# EAGLE schematic Main_ATMEGA328P (EAGLE 6.4)
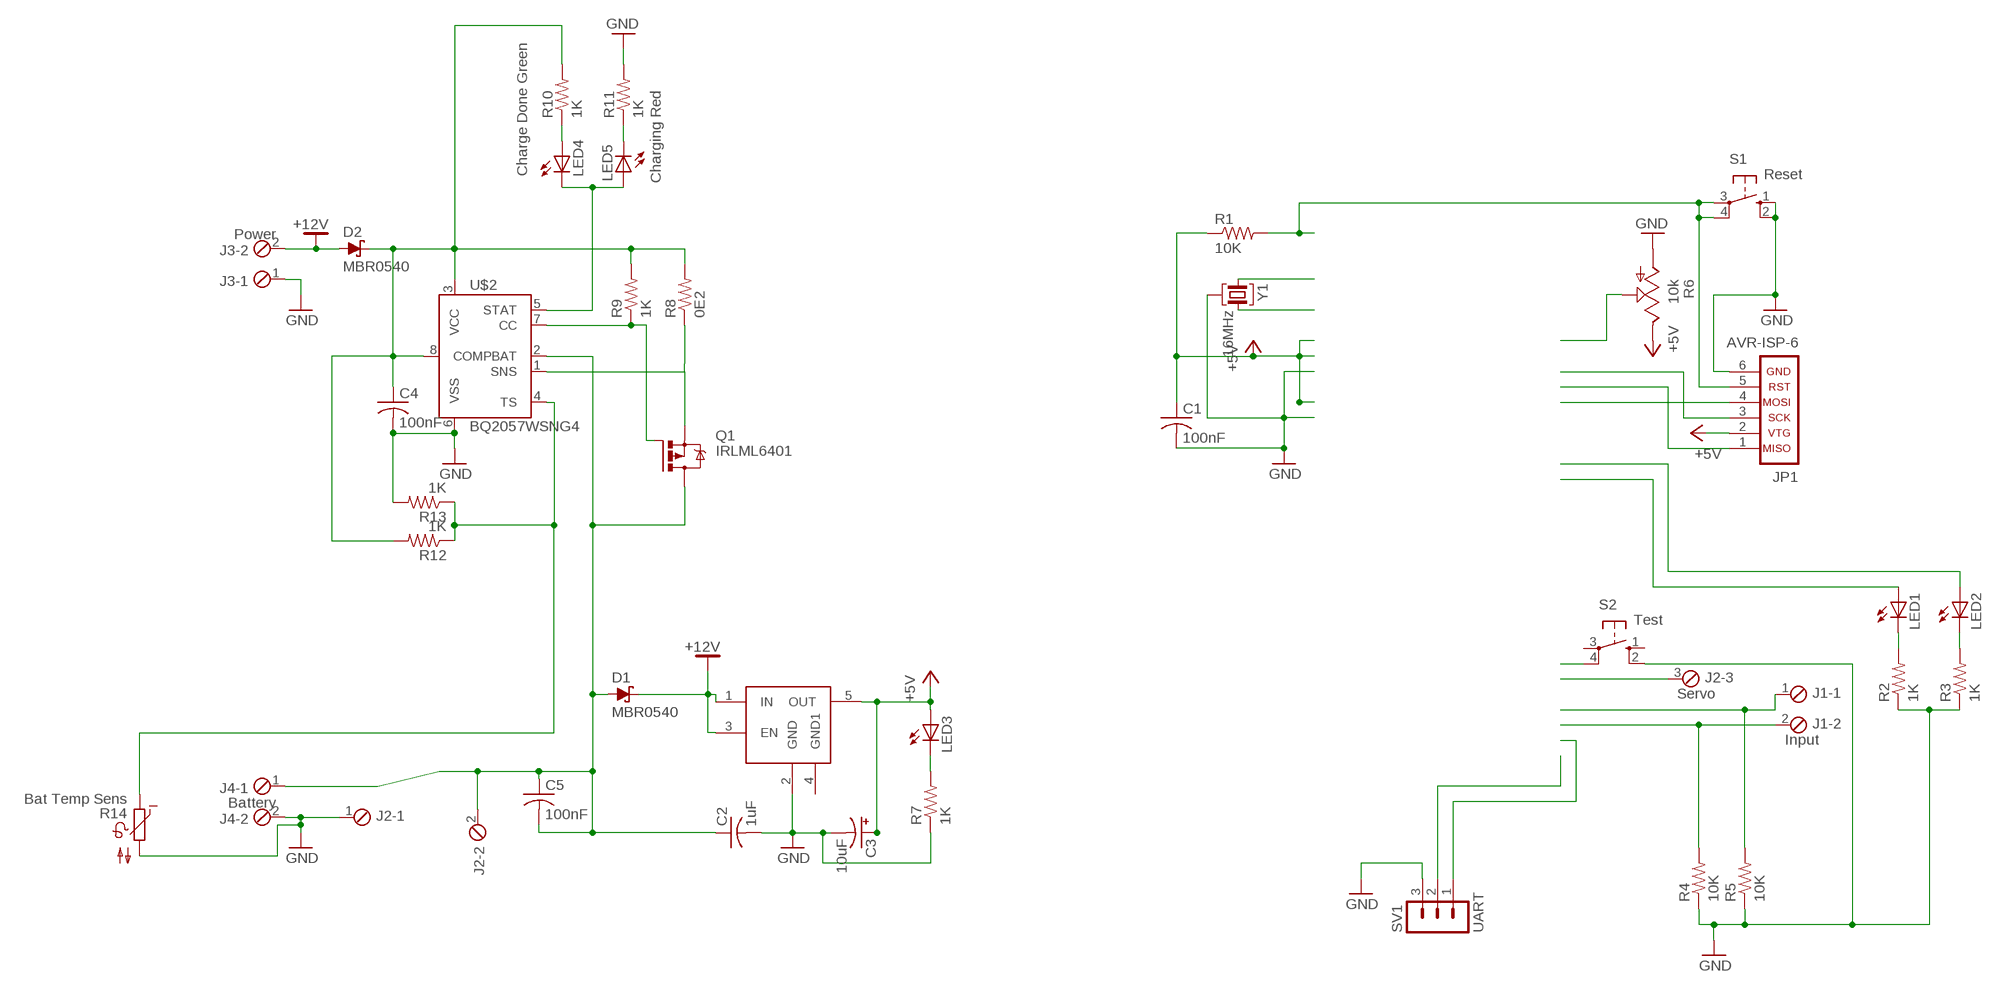
[diagram p0: schematic, sheet 1]

## Parts
C1  100nF  C-USC0805K  [C0805K]
C2  1uF  C-USC0805K  [C0805K]
C3  10uF  CPOL-USE2.5-7  [E2,5-7]
C4  100nF  C-USC0805K  [C0805K]
C5  100nF  C-USC0805K  [C0805K]
D1  MBR0540  [SOD123]
D2  MBR0540  [SOD123]
J1  Input  796689-2  [796689-2]
J2  Servo  796689-3  [796689-3]
J3  Power  796689-2  [796689-2]
J4  Battery  796689-2  [796689-2]
JP1  AVR-ISP-6  [AVR-ISP-6]
LED1  LEDCHIPLED_0805  [CHIPLED_0805]
LED2  LEDCHIPLED_0805  [CHIPLED_0805]
LED3  LEDCHIPLED_0805  [CHIPLED_0805]
LED4  Charge Done Green  LEDCHIPLED_0805  [CHIPLED_0805]
LED5  Charging Red  LEDCHIPLED_0805  [CHIPLED_0805]
Q1  IRLML6401  IRLML5203  [MICRO3]
R1  10K  R-US_R0805  [R0805]
R2  1K  R-US_R0805  [R0805]
R3  1K  R-US_R0805  [R0805]
R4  10K  R-US_R0805  [R0805]
R5  10K  R-US_R0805  [R0805]
R6  10k  TRIM_US-PT-10  [PT-10]
R7  1K  R-US_R0805  [R0805]
R8  0E2  R-US_M1206  [M1206]
R9  1K  R-US_R0805  [R0805]
R10  1K  R-US_R0805  [R0805]
R11  1K  R-US_R0805  [R0805]
R12  1K  R-US_R0805  [R0805]
R13  1K  R-US_R0805  [R0805]
R14  Bat Temp Sens  NTC640  [P640]
S1  Reset  10-XX  [B3F-10XX]
S2  Test  10-XX  [B3F-10XX]
SV1  UART  MA03-1  [MA03-1]
U$1  LP2981-50  TPS783XX  [DBV-R-PDSO-G5]
U$2  BQ2057WSNG4  [D_R-PDSO-G8]
Y1  16MHz  ZTT5X10  [5X10-3]

## Nets
+5V: C1.1 C3.+ JP1.2 LED3.A R1.1 R6.E U$1.5(OUT)
+12V: D1.C D2.A J3.2 U$1.1(IN) U$1.3(EN)
GND: C1.2 C2.2 C3.- C4.2 J2.1 J3.1 J4.2 JP1.6 R2.1 R3.1 R4.1 R5.1 R6.A R7.1 R11.2 R13.2 R14.2 S1.1(S) S1.2(S1) S2.2(S1) SV1.3 U$1.2(GND) U$2.6(VSS) Y1.2
N$1: J1.2 R4.2
N$2: JP1.5 R1.2 S1.3(P) S1.4(P1)
N$3: JP1.3
N$4: JP1.4
N$5: JP1.1
N$6: J1.1 R5.2
N$7: SV1.1
N$8: LED4.C LED5.A U$2.5(STAT)
N$9: Y1.3
N$10: Y1.1
N$11: J2.3
N$12: LED1.C R2.2
N$13: LED2.C R3.2
N$14: SV1.2
N$15: LED1.A
N$16: R6.S
N$17: LED2.A
N$18: LED3.C R7.2
N$19: S2.4(P1)
N$20: C2.1 C5.1 C5.2 D1.A J2.2 J4.1 Q1.3(D) U$2.2(BAT)
N$27: Q1.2(S) R8.1 U$2.1(SNS)
N$29: Q1.1(G) R9.1 U$2.7(CC)
N$30: LED5.C R11.1
N$31: LED4.A R10.1
N$32: R12.1 R13.1 R14.1 U$2.4(TS)
N$34: C4.1 D2.C R8.2 R9.2 R10.2 R12.2 U$2.3(VCC) U$2.8(COMP)
Unconnected: S2.1(S) S2.3(P) U$1.4(GND1)

## Library data of the parts
C1 C2 C4 C5 = resistor:C-US: CAPACITOR, American symbol
C3 = resistor:CPOL-US: POLARIZED CAPACITOR, American symbol
D1 D2 = diode:MBR0540: schottky diode, 0.5A, 40V ON Semiconductor
J1 J3 J4 = con-tyco:796689-2: TERMINAL BLOCK 5 mm, Euro Style
J2 = con-tyco:796689-3: TERMINAL BLOCK 5 mm, Euro Style
JP1 = atmel:AVR-ISP-6: AVR ISP-6 Serial Programming Header
LED1-LED5 = led:LED: LED OSRAM: - CHIPLED LG R971, LG N971, LY N971, LG Q971, LY Q971, LO R971, LY R971 LH N974, LH R974 LS Q976, LO Q976, LY Q976 LO Q996 - Hyper CHIPLED LW Q18S LB Q993, LB Q99A, LB R99A - SideLED LS A670, LO A670, LY A670, LG A670, LP A670 LB A673, LV A673, LT A673, LW A673 LH A674 LY A675 LS A676, LA A676, LO A676, LY A676, LW A676 LS A679, LY A679, LG A679 - Hyper Micro SIDELED® LS Y876, LA Y876, LO Y876, LY Y876 LT Y87S - SmartLED LW L88C, LW L88S LB L89C, LB L89S, LG L890 LS L89K, LO L89K, LY L89K LS L896, LA L896, LO L896, LY L896 - TOPLED LS T670, LO T670, LY T670, LG T670, LP T670 LSG T670, LSP T670, LSY T670, LOP T670, LYG T670 LG T671, LOG T671, LSG T671 LB T673, LV T673, LT T673, LW T673 LH T674 LS T676, LA T676, LO T676, LY T676, LB T676, LH T676, LSB T676, LW T676 LB T67C, LV T67C, LT T67C, LS T67K, LO T67K, LY T67K, LW E67C LS E67B, LA E67B, LO E67B, LY E67B, LB E67C, LV E67C, LT E67C LW T67C LS T679, LY T679, LG T679 LS T770, LO T770, LY T770, LG T770, LP T770 LB T773, LV T773, LT T773, LW T773 LH T774 LS E675, LA E675, LY E675, LS T675 LS T776, LA T776, LO T776, LY T776, LB T776 LHGB T686 LT T68C, LB T68C - Hyper Mini TOPLED® LB M676 - Mini TOPLED Santana® LG M470 LS M47K, LO M47K, LY M47K Source: http://www.osram.convergy.de LUXEON: - LUMILED® LXK2-PW12-R00, LXK2-PW12-S00, LXK2-PW14-U00, LXK2-PW14-V00 LXK2-PM12-R00, LXK2-PM12-S00, LXK2-PM14-U00 LXK2-PE12-Q00, LXK2-PE12-R00, LXK2-PE12-S00, LXK2-PE14-T00, LXK2-PE14-U00 LXK2-PB12-K00, LXK2-PB12-L00, LXK2-PB12-M00, LXK2-PB14-N00, LXK2-PB14-P00, LXK2-PB14-Q00 LXK2-PR12-L00, LXK2-PR12-M00, LXK2-PR14-Q00, LXK2-PR14-R00 LXK2-PD12-Q00, LXK2-PD12-R00, LXK2-PD12-S00 LXK2-PH12-R00, LXK2-PH12-S00 LXK2-PL12-P00, LXK2-PL12-Q00, LXK2-PL12-R00 Source: www.luxeon.com KINGBRIGHT: KA-3528ASYC Source: www.kingbright.com
Q1 = transistor-power:IRLML5203: HEXFET P-Channel Power MOSFET
R1-R5 R7-R13 = resistor:R-US_: RESISTOR, American symbol
R6 = pot:TRIM_US-: POTENTIOMETER
R14 = ptc-ntc:NTC640: PHILIPS NTC; OC_FARNELL: unknown; OC_NEWARK: unknown
S1 S2 = switch-omron:10-XX: OMRON SWITCH; MPN: B3F-1000; OC_FARNELL: 176432; OC_NEWARK: 36M3542
SV1 = con-lstb:MA03-1: PIN HEADER; OC_FARNELL: unknown; OC_NEWARK: unknown
U$1 = RobThePyro:TPS783XX
U$2 = RobThePyro:BQ2057WSNG4: TI BQ2057WSNG4 1-2Cell Li-ion / lipo charger IC http://www.ti.com/lit/ds/symlink/bq2057w.pdf
Y1 = crystal:ZTT: CERAMIC RESONATOR